# EAGLE schematic Vario Kobo (EAGLE 6.1)

## Sheet 1 of 2: Alimentation
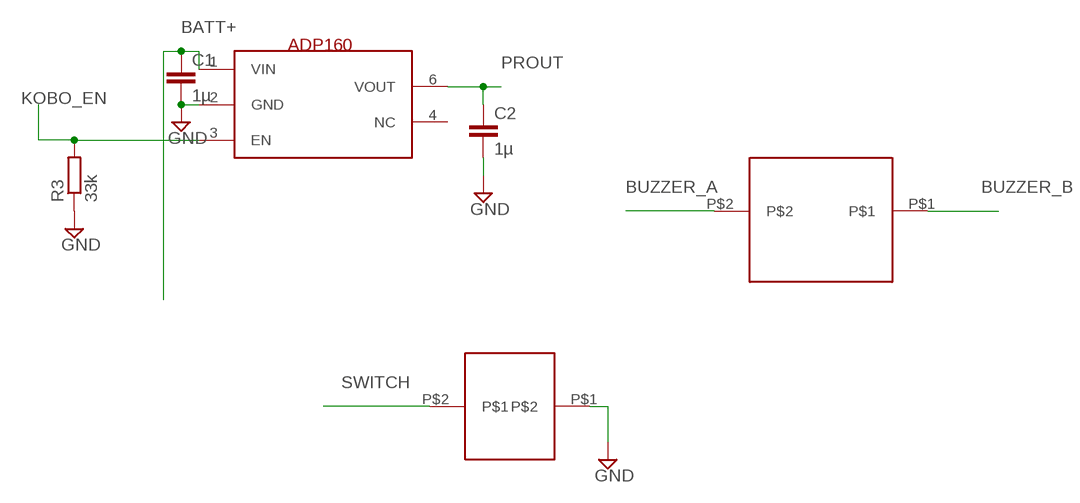
[diagram p0: schematic, sheet 1]

### Parts
ADP160  ADP160/161/162/163  [TSOT23-6_DDC]
BUTTON  SMS_J_LEAD  [SMS_J_LEAD]
BUZZER  PKLCS1212E2000-R1  [PKLCS1212E2000-R1-SMD]
C1  1µ  C-EUC0603  [C0603]
C2  1µ  C-EUC0603  [C0603]
R3  33k  R-EU_R0603  [R0603]

### Nets
BATT+: ADP160.1(VIN) C1.1 ; also sheet 2
BUZZER_A: BUZZER.P$2 ; also sheet 2
BUZZER_B: BUZZER.P$1 ; also sheet 2
GND: ADP160.2(GND) BUTTON.P$1 C1.2 C2.2 R3.1 ; also sheet 2
KOBO_EN: ADP160.3(EN) R3.2 ; also sheet 2
PROUT: ADP160.6(VOUT) C2.1 ; also sheet 2
SWITCH: BUTTON.P$2 ; also sheet 2
Unconnected: ADP160.4(NC)

## Sheet 2 of 2: Vario Core
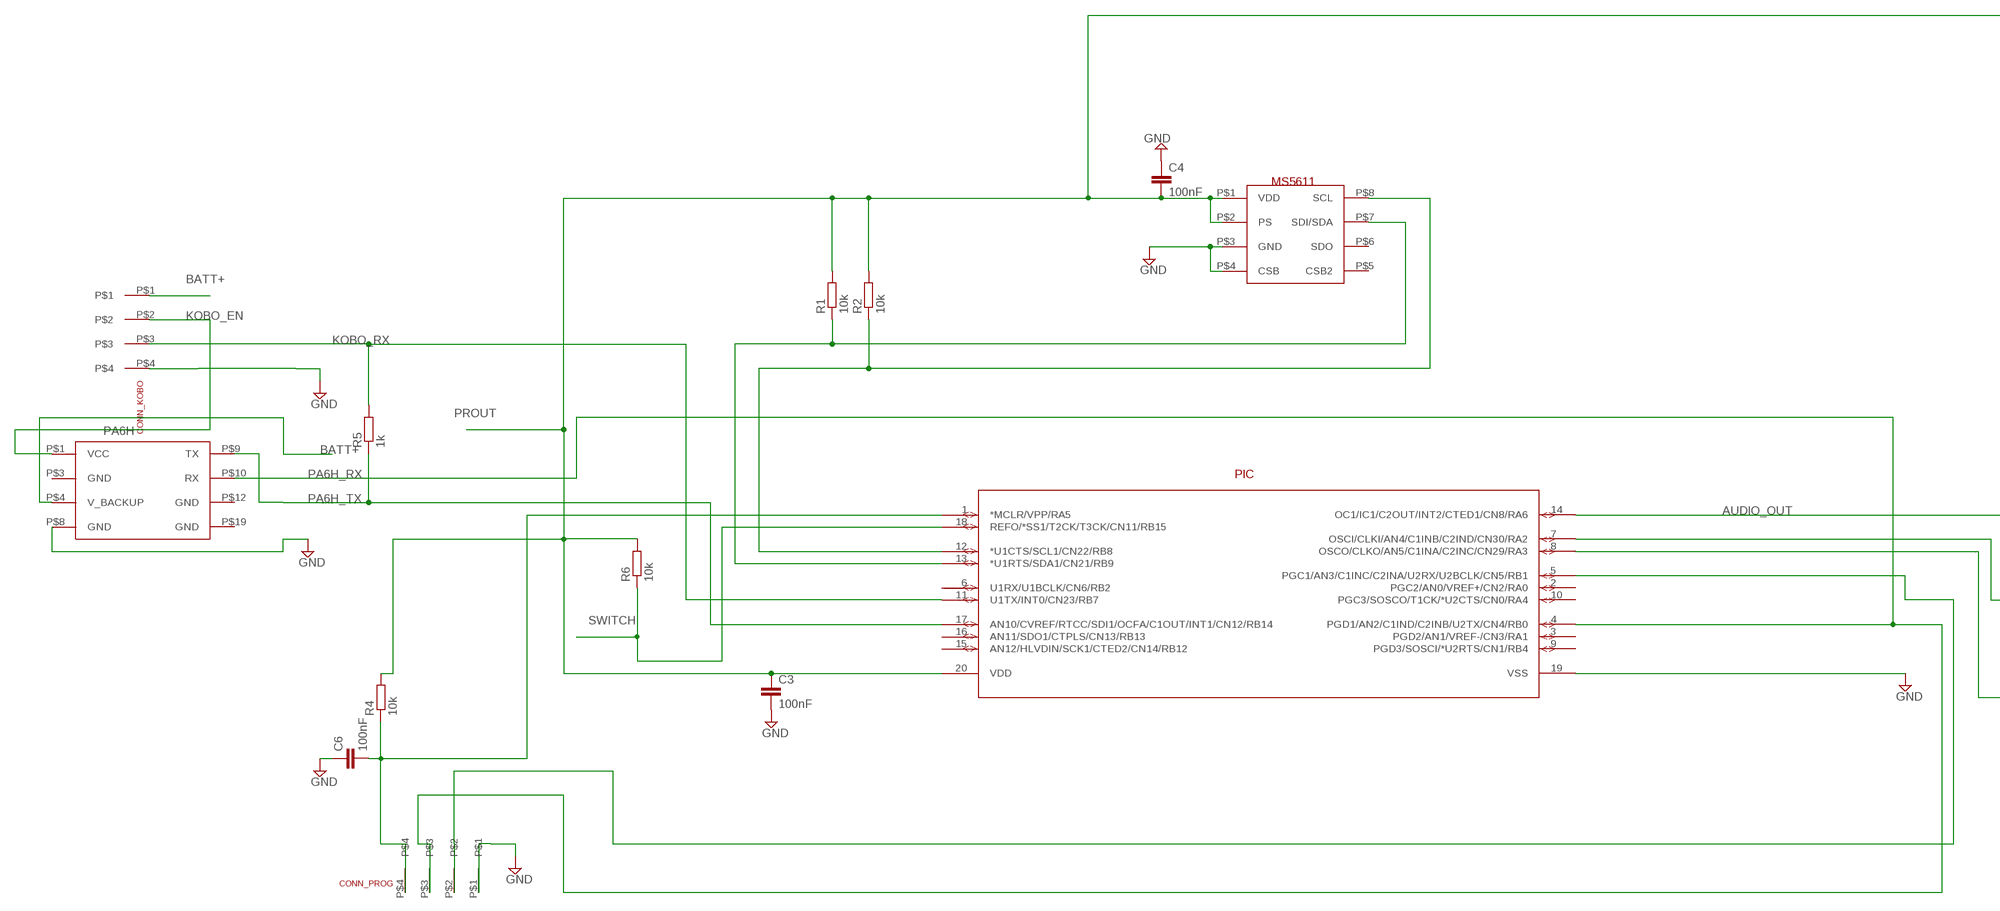
[diagram p1: schematic, sheet 2, part 1 of 2]
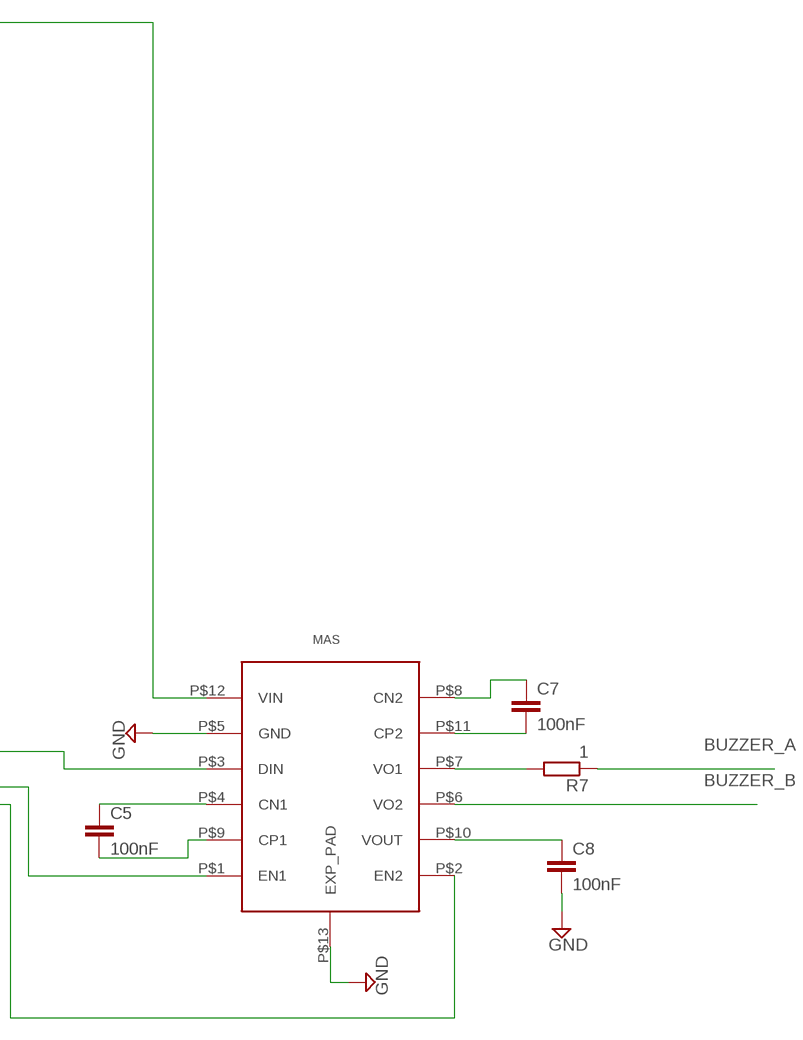
[diagram p2: schematic, sheet 2, part 2 of 2]

### Parts
C3  100nF  C-EUC0603  [C0603]
C4  100nF  C-EUC0603  [C0603]
C5  100nF  C-EUC0603  [C0603]
C6  100nF  C-EUC0603  [C0603]
C7  100nF  C-EUC0603  [C0603]
C8  100nF  C-EUC0603  [C0603]
CONN_KOBO  PICO-EZMATE4  [PICO-EZMATE4-PCB]
CONN_PROG  PICO-EZMATE4  [PICO-EZMATE4-PCB]
MAS  MAS6240  [QFN12_3X3]
MS5611  MS5607PACKAGED  [MS5607-02BA03]
PA6H  PA6H  [PA6H_PRINT]
PIC  PIC24F16KA101-X_  [SSOP20_MC]
R1  10k  R-EU_R0603  [R0603]
R2  10k  R-EU_R0603  [R0603]
R4  10k  R-EU_R0603  [R0603]
R5  1k  R-EU_R0603  [R0603]
R6  10k  R-EU_R0603  [R0603]
R7  1  R-EU_R0603  [R0603]

### Nets
AUDIO_OUT: MAS.P$3(DIN) PIC.14(OC1/IC1/C2OUT/INT2/CTED1/CN8/RA6)
BATT+: CONN_KOBO.P$1 PA6H.P$4(V_BACKUP) ; also sheet 1
BUZZER_A: R7.1 ; also sheet 1
BUZZER_B: MAS.P$6(VO2) ; also sheet 1
GND: C3.2 C4.1 C6.1 C8.2 CONN_KOBO.P$4 CONN_PROG.P$1 MAS.P$5(GND) MAS.P$13(EXP_PAD) MS5611.P$3(GND) MS5611.P$4(CSB) PA6H.P$8(GND) PIC.19(VSS) ; also sheet 1
KOBO_EN: CONN_KOBO.P$2 PA6H.P$1(VCC) ; also sheet 1
KOBO_RX: CONN_KOBO.P$3 PIC.11(U1TX/INT0/CN23/RB7) R5.2
MCLR: C6.2 CONN_PROG.P$4 PIC.1(*MCLR/VPP/RA5) R4.1
N$3: C8.1 MAS.P$10(VOUT)
N$4: C5.1 MAS.P$4(CN1)
N$5: C5.2 MAS.P$9(CP1)
N$6: C7.2 MAS.P$11(CP2)
N$7: C7.1 MAS.P$8(CN2)
N$8: MAS.P$7(VO1) R7.2
N$9: MAS.P$1(EN1) PIC.7(OSCI/CLKI/AN4/C1INB/C2IND/CN30/RA2)
N$11: MAS.P$2(EN2) PIC.8(OSCO/CLKO/AN5/C1INA/C2INC/CN29/RA3)
PA6H_RX: CONN_PROG.P$3 PA6H.P$10(RX) PIC.4(PGD1/AN2/C1IND/C2INB/U2TX/CN4/RB0)
PA6H_TX: PA6H.P$9(TX) PIC.17(AN10/CVREF/RTCC/SDI1/OCFA/C1OUT/INT1/CN12/RB14) R5.1
PGC: CONN_PROG.P$2 PIC.5(PGC1/AN3/C1INC/C2INA/U2RX/U2BCLK/CN5/RB1)
PROUT: C3.1 C4.2 MAS.P$12(VIN) MS5611.P$1(VDD) MS5611.P$2(PS) PIC.20(VDD) R1.2 R2.2 R4.2 R6.2 ; also sheet 1
SCL: MS5611.P$8(SCL) PIC.12(*U1CTS/SCL1/CN22/RB8) R2.1
SDA: MS5611.P$7(SDI/SDA) PIC.13(*U1RTS/SDA1/CN21/RB9) R1.1
SWITCH: PIC.18(REFO/*SS1/T2CK/T3CK/CN11/RB15) R6.1 ; also sheet 1
Unconnected: MS5611.P$5(CSB2) MS5611.P$6(SDO) PA6H.P$3(GND) PA6H.P$12(GND) PA6H.P$19(GND) PIC.2(PGC2/AN0/VREF+/CN2/RA0) PIC.3(PGD2/AN1/VREF-/CN3/RA1) PIC.6(U1RX/U1BCLK/CN6/RB2) PIC.9(PGD3/SOSCI/*U2RTS/CN1/RB4) PIC.10(PGC3/SOSCO/T1CK/*U2CTS/CN0/RA4) PIC.15(AN12/HLVDIN/SCK1/CTED2/CN14/RB12) PIC.16(AN11/SDO1/CTPLS/CN13/RB13)

## Library data of the parts
ADP160 = analog-devices:ADP160/161/162/163: LDO, low Iq Linear Voltage Regulator
BUTTON = schurter:SMS_J_LEAD
BUZZER = murata_buzzers:PKLCS1212E2000-R1
C1-C8 = rcl:C-EU: CAPACITOR, European symbol
CONN_KOBO CONN_PROG = molex:PICO-EZMATE4
MAS = mas:MAS6240
MS5611 = measurement_specialties:MS5607PACKAGED
PA6H = gtop:PA6H
PIC = microchip:PIC24F16KA101-X_
R1-R7 = rcl:R-EU_: RESISTOR, European symbol